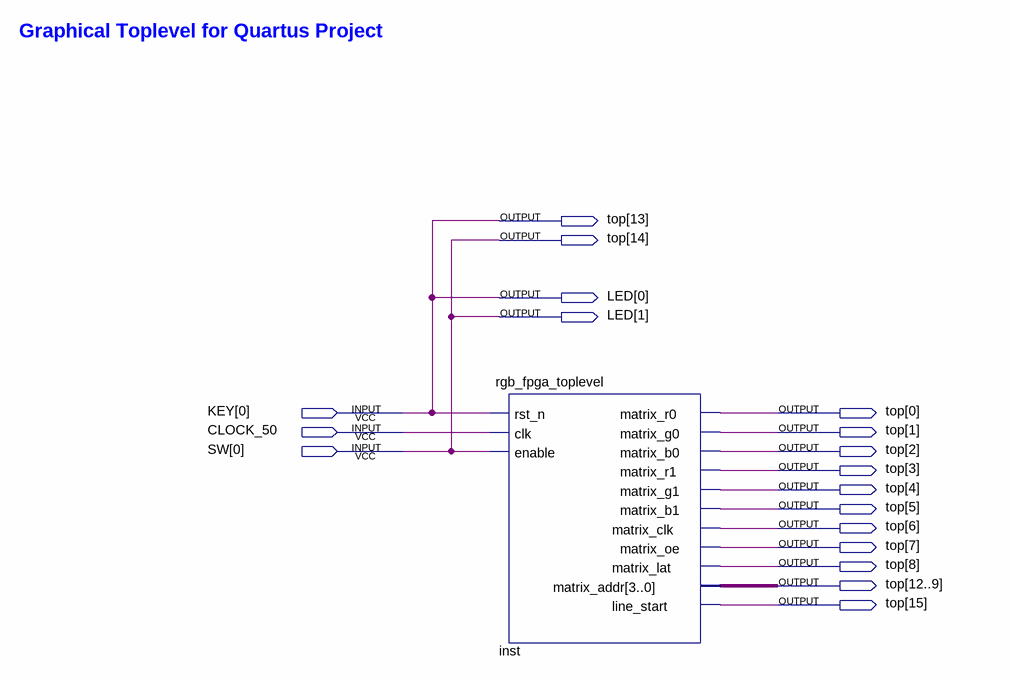
[diagram p0: schematic sheet]
// Quartus schematic rgb_led_matrix_fpga_block.bdf as structural Verilog: 1 symbols, 18 pins
module rgb_led_matrix_fpga_block (
  input  [0:0] KEY,
  input  CLOCK_50,
  input  [0:0] SW,
  output [15:0] top,
  output [1:0] LED
);

  rgb_fpga_toplevel inst (
    .rst_n(KEY[0]), .clk(CLOCK_50), .enable(SW[0]), .matrix_r0(top[0]), .matrix_g0(top[1]),
    .matrix_b0(top[2]), .matrix_r1(top[3]), .matrix_g1(top[4]), .matrix_b1(top[5]), .matrix_clk(top[6]),
    .matrix_oe(top[7]), .matrix_lat(top[8]), .matrix_addr(top[12:9]), .line_start(top[15]));

  assign LED = {SW[0], KEY[0]};
  assign top[14:13] = {SW[0], KEY[0]};

  // Notes on the sheet:
  //   Graphical Toplevel for Quartus Project
endmodule
